# Altium schematic sheet JP-QDB.SchDoc
size A3
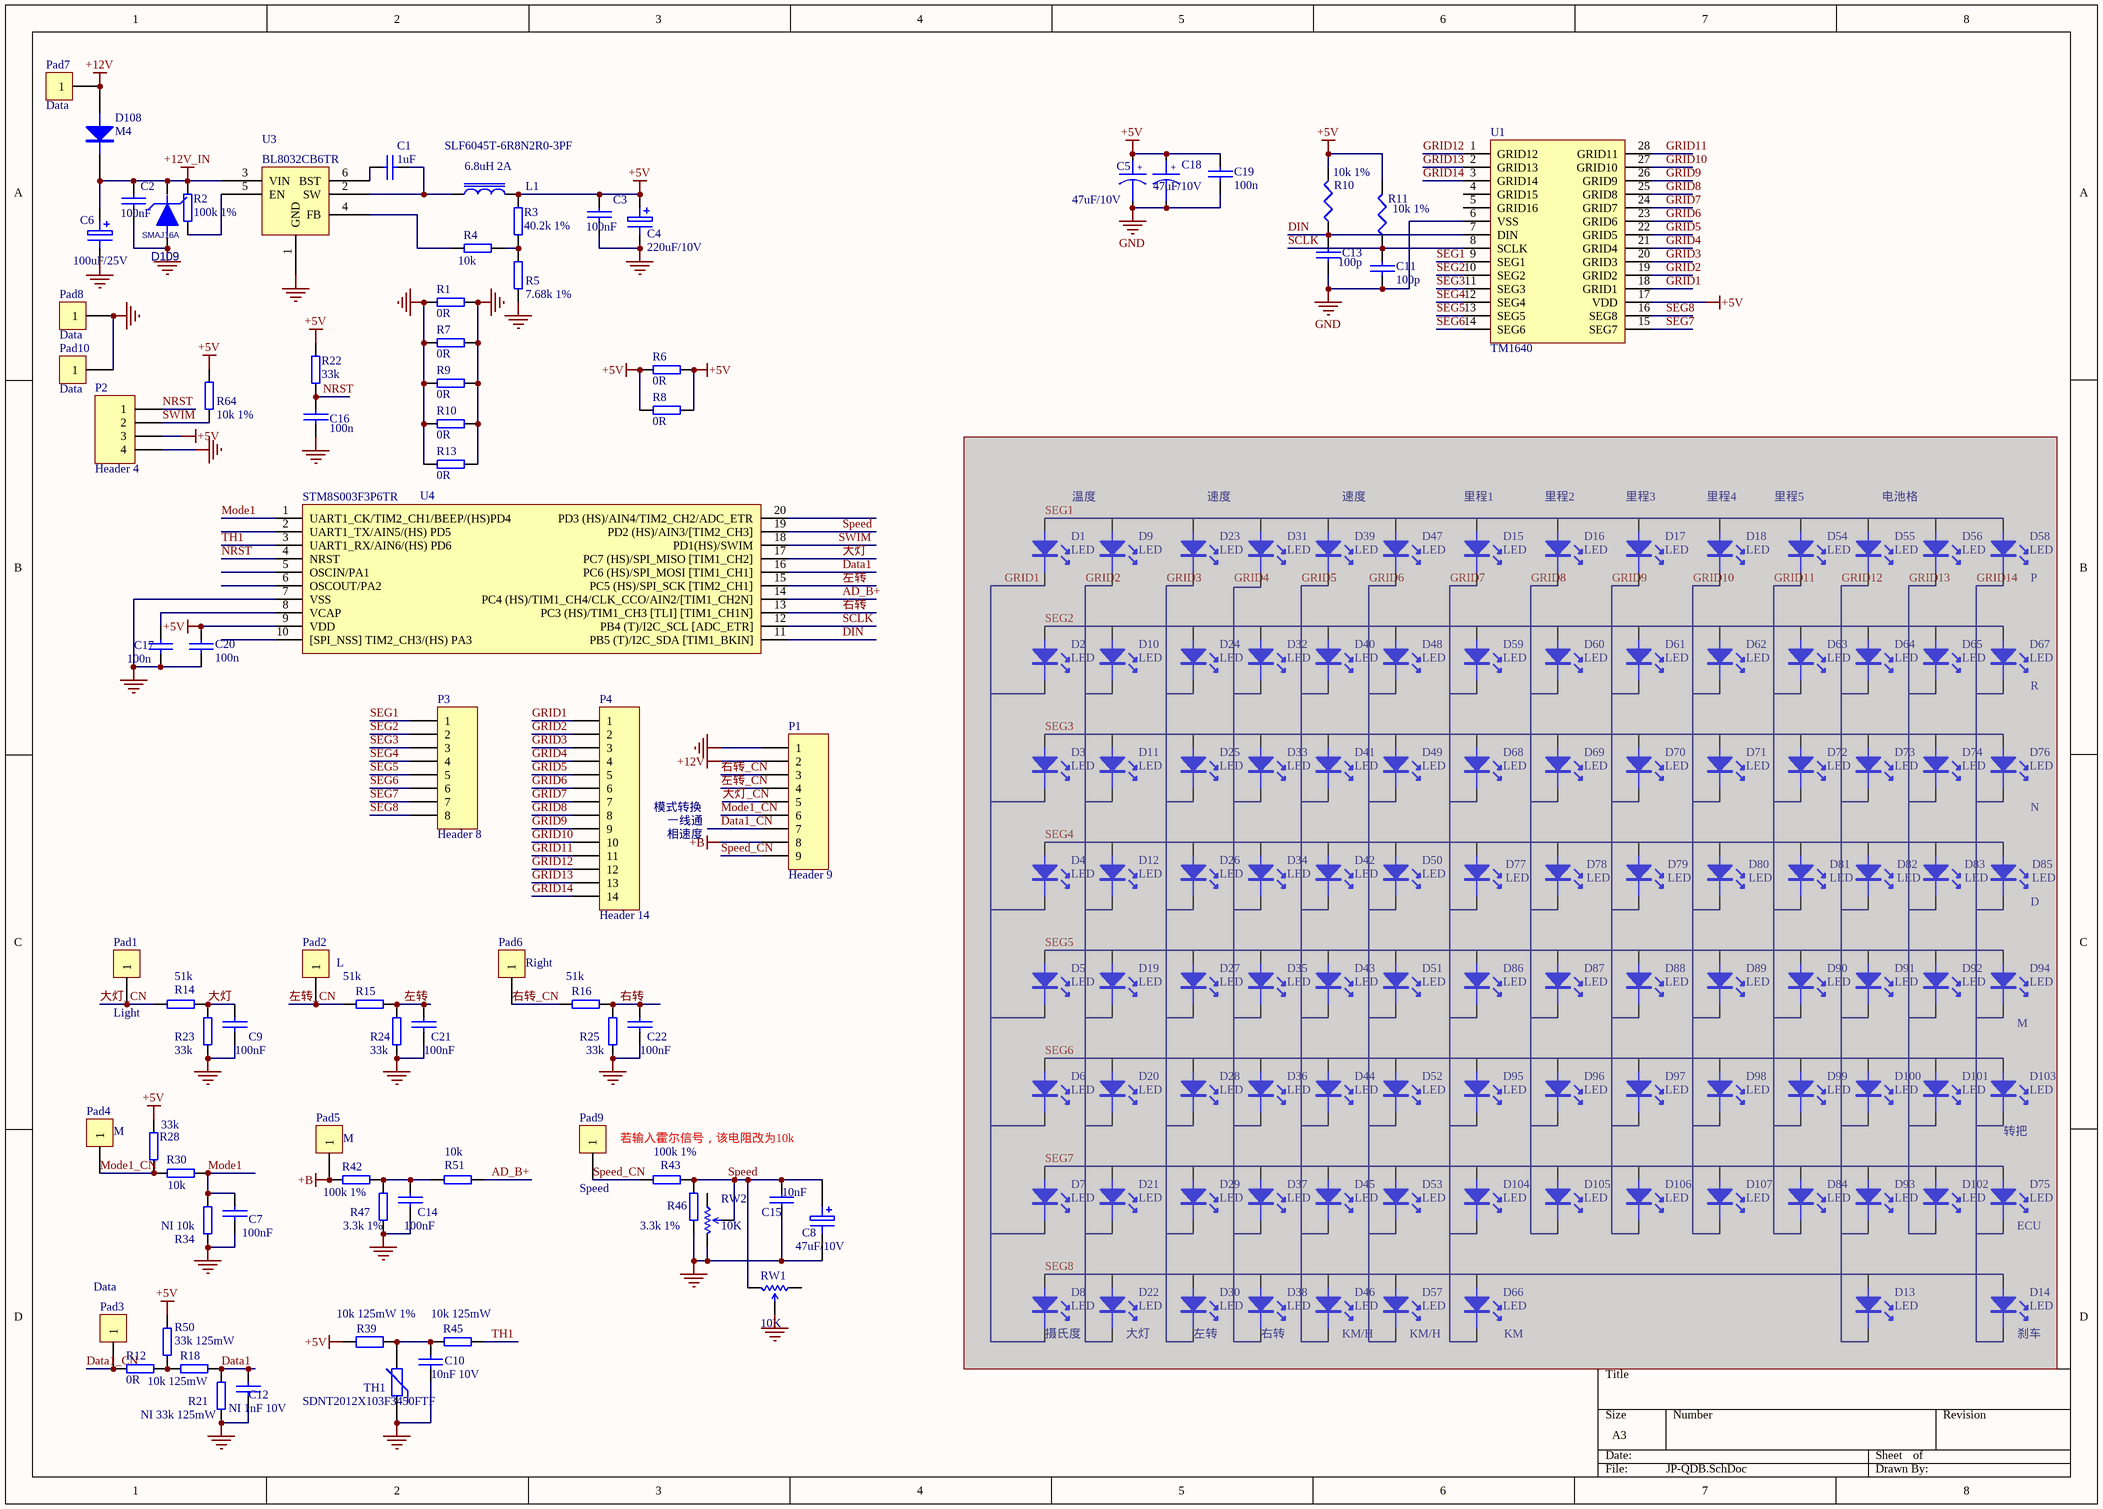
[diagram p0: JP-QDB.SchDoc]

## Parts
C1  1uF  [0805]
C2  100nF  [0805]
C3  100nF  [0805]
C4  220uF/10V  [CE-D6.4]
C5  47uF/10V  [CE-D5.2]
C6  100uF/25V  [RB.1/.2]
C7  100nF  [0805]
C8  47uF/10V  [RB.1/.2]
C9  100nF  [0805]
C10  10nF 10V  [0603]
C11  100p  [0805]
C12  NI 1nF 10V  [0603]
C13  100p  [0805]
C14  100nF  [0805]
C15  10nF  [0603]
C16  100n  [0603]
C17  100n  [0603]
C18  47uF/10V  [CE-D5.2]
C19  100n  [0603]
C20  100n  [0603]
C21  100nF  [0805]
C22  100nF  [0805]
D1  LED  [0603]  (masked out: inside a compile mask, not in the netlist)
D2  LED  [0603]  (masked out: inside a compile mask, not in the netlist)
D3  LED  [0603]  (masked out: inside a compile mask, not in the netlist)
D4  LED  [0603]  (masked out: inside a compile mask, not in the netlist)
D5  LED  [0603]  (masked out: inside a compile mask, not in the netlist)
D6  LED  [0603]  (masked out: inside a compile mask, not in the netlist)
D7  LED  [0603]  (masked out: inside a compile mask, not in the netlist)
D8  LED  [0603]  (masked out: inside a compile mask, not in the netlist)
D9  LED  [0603]  (masked out: inside a compile mask, not in the netlist)
D10  LED  [0603]  (masked out: inside a compile mask, not in the netlist)
D11  LED  [0603]  (masked out: inside a compile mask, not in the netlist)
D12  LED  [0603]  (masked out: inside a compile mask, not in the netlist)
D13  LED  [0603]  (masked out: inside a compile mask, not in the netlist)
D14  LED  [0603]  (masked out: inside a compile mask, not in the netlist)
D15  LED  [0603]  (masked out: inside a compile mask, not in the netlist)
D16  LED  [0603]  (masked out: inside a compile mask, not in the netlist)
D17  LED  [0603]  (masked out: inside a compile mask, not in the netlist)
D18  LED  [0603]  (masked out: inside a compile mask, not in the netlist)
D19  LED  [0603]  (masked out: inside a compile mask, not in the netlist)
D20  LED  [0603]  (masked out: inside a compile mask, not in the netlist)
D21  LED  [0603]  (masked out: inside a compile mask, not in the netlist)
D22  LED  [0603]  (masked out: inside a compile mask, not in the netlist)
D23  LED  [0603]  (masked out: inside a compile mask, not in the netlist)
D24  LED  [0603]  (masked out: inside a compile mask, not in the netlist)
D25  LED  [0603]  (masked out: inside a compile mask, not in the netlist)
D26  LED  [0603]  (masked out: inside a compile mask, not in the netlist)
D27  LED  [0603]  (masked out: inside a compile mask, not in the netlist)
D28  LED  [0603]  (masked out: inside a compile mask, not in the netlist)
D29  LED  [0603]  (masked out: inside a compile mask, not in the netlist)
D30  LED  [0603]  (masked out: inside a compile mask, not in the netlist)
D31  LED  [0603]  (masked out: inside a compile mask, not in the netlist)
D32  LED  [0603]  (masked out: inside a compile mask, not in the netlist)
D33  LED  [0603]  (masked out: inside a compile mask, not in the netlist)
D34  LED  [0603]  (masked out: inside a compile mask, not in the netlist)
D35  LED  [0603]  (masked out: inside a compile mask, not in the netlist)
D36  LED  [0603]  (masked out: inside a compile mask, not in the netlist)
D37  LED  [0603]  (masked out: inside a compile mask, not in the netlist)
D38  LED  [0603]  (masked out: inside a compile mask, not in the netlist)
D39  LED  [0603]  (masked out: inside a compile mask, not in the netlist)
D40  LED  [0603]  (masked out: inside a compile mask, not in the netlist)
D41  LED  [0603]  (masked out: inside a compile mask, not in the netlist)
D42  LED  [0603]  (masked out: inside a compile mask, not in the netlist)
D43  LED  [0603]  (masked out: inside a compile mask, not in the netlist)
D44  LED  [0603]  (masked out: inside a compile mask, not in the netlist)
D45  LED  [0603]  (masked out: inside a compile mask, not in the netlist)
D46  LED  [0603]  (masked out: inside a compile mask, not in the netlist)
D47  LED  [0603]  (masked out: inside a compile mask, not in the netlist)
D48  LED  [0603]  (masked out: inside a compile mask, not in the netlist)
D49  LED  [0603]  (masked out: inside a compile mask, not in the netlist)
D50  LED  [0603]  (masked out: inside a compile mask, not in the netlist)
D51  LED  [0603]  (masked out: inside a compile mask, not in the netlist)
D52  LED  [0603]  (masked out: inside a compile mask, not in the netlist)
D53  LED  [0603]  (masked out: inside a compile mask, not in the netlist)
D54  LED  [0603]  (masked out: inside a compile mask, not in the netlist)
D55  LED  [0603]  (masked out: inside a compile mask, not in the netlist)
D56  LED  [0603]  (masked out: inside a compile mask, not in the netlist)
D57  LED  [0603]  (masked out: inside a compile mask, not in the netlist)
D58  LED  [0603]  (masked out: inside a compile mask, not in the netlist)
D59  LED  [0603]  (masked out: inside a compile mask, not in the netlist)
D60  LED  [0603]  (masked out: inside a compile mask, not in the netlist)
D61  LED  [0603]  (masked out: inside a compile mask, not in the netlist)
D62  LED  [0603]  (masked out: inside a compile mask, not in the netlist)
D63  LED  [0603]  (masked out: inside a compile mask, not in the netlist)
D64  LED  [0603]  (masked out: inside a compile mask, not in the netlist)
D65  LED  [0603]  (masked out: inside a compile mask, not in the netlist)
D66  LED  [0603]  (masked out: inside a compile mask, not in the netlist)
D67  LED  [0603]  (masked out: inside a compile mask, not in the netlist)
D68  LED  [0603]  (masked out: inside a compile mask, not in the netlist)
D69  LED  [0603]  (masked out: inside a compile mask, not in the netlist)
D70  LED  [0603]  (masked out: inside a compile mask, not in the netlist)
D71  LED  [0603]  (masked out: inside a compile mask, not in the netlist)
D72  LED  [0603]  (masked out: inside a compile mask, not in the netlist)
D73  LED  [0603]  (masked out: inside a compile mask, not in the netlist)
D74  LED  [0603]  (masked out: inside a compile mask, not in the netlist)
D75  LED  [0603]  (masked out: inside a compile mask, not in the netlist)
D76  LED  [0603]  (masked out: inside a compile mask, not in the netlist)
D77  LED  [0603]  (masked out: inside a compile mask, not in the netlist)
D78  LED  [0603]  (masked out: inside a compile mask, not in the netlist)
D79  LED  [0603]  (masked out: inside a compile mask, not in the netlist)
D80  LED  [0603]  (masked out: inside a compile mask, not in the netlist)
D81  LED  [0603]  (masked out: inside a compile mask, not in the netlist)
D82  LED  [0603]  (masked out: inside a compile mask, not in the netlist)
D83  LED  [0603]  (masked out: inside a compile mask, not in the netlist)
D84  LED  [0603]  (masked out: inside a compile mask, not in the netlist)
D85  LED  [0603]  (masked out: inside a compile mask, not in the netlist)
D86  LED  [0603]  (masked out: inside a compile mask, not in the netlist)
D87  LED  [0603]  (masked out: inside a compile mask, not in the netlist)
D88  LED  [0603]  (masked out: inside a compile mask, not in the netlist)
D89  LED  [0603]  (masked out: inside a compile mask, not in the netlist)
D90  LED  [0603]  (masked out: inside a compile mask, not in the netlist)
D91  LED  [0603]  (masked out: inside a compile mask, not in the netlist)
D92  LED  [0603]  (masked out: inside a compile mask, not in the netlist)
D93  LED  [0603]  (masked out: inside a compile mask, not in the netlist)
D94  LED  [0603]  (masked out: inside a compile mask, not in the netlist)
D95  LED  [0603]  (masked out: inside a compile mask, not in the netlist)
D96  LED  [0603]  (masked out: inside a compile mask, not in the netlist)
D97  LED  [0603]  (masked out: inside a compile mask, not in the netlist)
D98  LED  [0603]  (masked out: inside a compile mask, not in the netlist)
D99  LED  [0603]  (masked out: inside a compile mask, not in the netlist)
D100  LED  [0603]  (masked out: inside a compile mask, not in the netlist)
D101  LED  [0603]  (masked out: inside a compile mask, not in the netlist)
D102  LED  [0603]  (masked out: inside a compile mask, not in the netlist)
D103  LED  [0603]  (masked out: inside a compile mask, not in the netlist)
D104  LED  [0603]  (masked out: inside a compile mask, not in the netlist)
D105  LED  [0603]  (masked out: inside a compile mask, not in the netlist)
D106  LED  [0603]  (masked out: inside a compile mask, not in the netlist)
D107  LED  [0603]  (masked out: inside a compile mask, not in the netlist)
D108  M4  [SMA]
D109  SMAJ16A  [SMA]
L1  SLF6045T-6R8N2R0-3PF  [L6025]
P1  Header 9  [SIP9]
P2  Header 4  [SIP4]
P3  Header 8  [HDR1X8]
P4  Header 14  [HDR1X14]
Pad1  Light  [PAD]
Pad2  L  [PAD]
Pad3  Data  [PAD]
Pad4  M  [PAD]
Pad5  M  [PAD]
Pad6  Right  [PAD]
Pad7  Data  [PAD]
Pad8  Data  [PAD]
Pad9  Speed  [PAD]
Pad10  Data  [PAD]
R1  0R  [1206]
R2  100k 1%  [0805]
R3  40.2k 1%  [0805]
R4  10k  [0603]
R5  7.68k 1%  [0603]
R6  0R  [1206]
R7  0R  [1206]
R8  0R  [1206]
R9  0R  [0805]
R10  10k 1%  [0805]
R10  0R  [0805]
R11  10k 1%  [0805]
R12  0R  [0805]
R13  0R  [0805]
R14  51k  [0805]
R15  51k  [0805]
R16  51k  [0805]
R18  10k 125mW  [0805]
R21  NI 33k 125mW  [0805]
R22  33k  [0805]
R23  33k  [0805]
R24  33k  [0805]
R25  33k  [0805]
R28  33k  [0805]
R30  10k  [0805]
R34  NI 10k  [0805]
R39  10k 125mW 1%  [0805]
R42  100k 1%  [0805]
R43  100k 1%  [0805]
R45  10k 125mW  [0805]
R46  3.3k 1%  [0805]
R47  3.3k 1%  [0805]
R50  33k 125mW  [0805]
R51  10k  [0805]
R64  10k 1%  [0805]
RW1  10K  [ADJRES]
RW2  10K  [RW1]
TH1  SDNT2012X103F3450FTF  [0805]
U1  TM1640  [SOP28]
U3  BL8032CB6TR  [SOT23-6]
U4  STM8S003F3P6TR  [SSOP20]

## Nets
+5V: C3.1 C4.1 C5.1 C18.1 C19.2 C20.2 L1.2 P2.3 R3.1 R6.1 R6.2 R8.1 R8.2 R10.2 R11.2 R22.2 R28.1 R39.2 R50.1 R64.1 U1.17(VDD) U4.9(VDD)
+12V: D108.1(A) P1.2 Pad7.1
+12V_IN: C2.1 C6.1 D108.2(K) D109.2 R2.1 U3.3(VIN)
+B: P1.8 Pad5.1 R42.2
GND: C2.2 C3.2 C4.2 C5.2 C6.2 C7.2 C8.2 C9.2 C10.2 C11.1 C12.2 C13.1 C14.2 C15.2 C16.1 C17.2 C18.2 C19.1 C20.1 C21.2 C22.2 D109.1 P1.1 P2.4 Pad8.1 Pad10.1 R1.1 R1.2 R5.1 R7.1 R7.2 R9.1 R9.2 R10.1 R10.2 R13.1 R13.2 R21.2 R23.2 R24.2 R25.2 R34.2 R46.2 R47.2 RW1.3 RW2.1 TH1.1 U1.6(VSS) U3.1(GND) U4.7(VSS)
AD_B+: R51.1 U4.14(PC4_(HS)/TIM1_CH4/CLK_CCO/AIN2/[TIM1_CH2N])
Data1: C12.1 R18.1 R21.1 U4.16(PC6_(HS)/SPI_MOSI_[TIM1_CH1])
Data1_CN: P1.7 Pad3.1 R12.1
DIN: C13.2 R10.1 U1.7(DIN) U4.11(PB5_(T)/I2C_SDA_[TIM1_BKIN])
GRID1: P4.1 U1.18(GRID1)
GRID2: P4.2 U1.19(GRID2)
GRID3: P4.3 U1.20(GRID3)
GRID4: P4.4 U1.21(GRID4)
GRID5: P4.5 U1.22(GRID5)
GRID6: P4.6 U1.23(GRID6)
GRID7: P4.7 U1.24(GRID7)
GRID8: P4.8 U1.25(GRID8)
GRID9: P4.9 U1.26(GRID9)
GRID10: P4.10 U1.27(GRID10)
GRID11: P4.11 U1.28(GRID11)
GRID12: P4.12 U1.1(GRID12)
GRID13: P4.13 U1.2(GRID13)
GRID14: P4.14 U1.3(GRID14)
Mode1: C7.1 R30.1 R34.1 U4.1(UART1_CK/TIM2_CH1/BEEP/(HS)PD4)
Mode1_CN: P1.6 Pad4.1 R28.2 R30.2
NRST: C16.2 P2.1 R22.1 U4.4(NRST)
SCLK: C11.2 R11.1 U1.8(SCLK) U4.12(PB4_(T)/I2C_SCL_[ADC_ETR])
SEG1: P3.1 U1.9(SEG1)
SEG2: P3.2 U1.10(SEG2)
SEG3: P3.3 U1.11(SEG3)
SEG4: P3.4 U1.12(SEG4)
SEG5: P3.5 U1.13(SEG5)
SEG6: P3.6 U1.14(SEG6)
SEG7: P3.7 U1.15(SEG7)
SEG8: P3.8 U1.16(SEG8)
Speed: C8.1 C15.1 R43.1 R46.1 RW1.1 RW2.3 U4.19(PD2_(HS)/AIN3/[TIM2_CH3])
Speed_CN: P1.9 Pad9.1 R43.2
SWIM: P2.2 R64.2 U4.18(PD1(HS)/SWIM)
TH1: R45.1 U4.3(UART1_RX/AIN6/(HS)_PD6)
右转: C22.1 R16.1 R25.1 U4.13(PC3_(HS)/TIM1_CH3_[TLI]_[TIM1_CH1N])
右转_CN: P1.3 Pad6.1 R16.2
大灯: C9.1 R14.1 R23.1 U4.17(PC7_(HS)/SPI_MISO_[TIM1_CH2])
大灯_CN: P1.5 Pad1.1 R14.2
左转: C21.1 R15.1 R24.1 U4.15(PC5_(HS)/SPI_SCK_[TIM2_CH1])
左转_CN: P1.4 Pad2.1 R15.2
NetC1_1: C1.1 L1.1 U3.2(SW)
NetC1_2: C1.2 U3.6(BST)
NetC10_1: C10.1 R39.1 R45.2 TH1.2
NetC14_1: C14.1 R42.1 R47.1 R51.2
NetC17_1: C17.1 U4.8(VCAP)
NetR2_2: R2.2 U3.5(EN)
NetR3_2: R3.2 R4.1 R5.2
NetR4_2: R4.2 U3.4(FB)
NetR12_2: R12.2 R18.2 R50.2

Not connected (* = marked no-connect by the designer): RW1 2; RW2 2; U1 4(GRID15) 5(GRID16); U4 2(UART1_TX/AIN5/(HS)_PD5) 5(OSCIN/PA1) 6(OSCOUT/PA2) 10([SPI_NSS]_TIM2_CH3/(HS)_PA3) 20(PD3_(HS)/AIN4/TIM2_CH2/ADC_ETR)

## Notes on the sheet
- 温度
- (near D23) 速度
- (near D39) 速度
- (near D15) 里程1
- (near D16) 里程2
- (near D17) 里程3
- (near D18) 里程4
- (near D54) 里程5
- 电池格
- (near D58) P
- (near D67) R
- 模式转换
- 一线通
- 相速度
- N
- (near D85) D
- (near D94) M
- 若输入霍尔信号，该电阻改为10k
- (near D103) 转把
- (near D75) ECU
- (near D8) 摄氏度
- (near D22) 大灯
- (near D30) 左转
- (near D38) 右转
- (near D46) KM/H
- (near D57) KM/H
- (near D66) KM
- (near D14) 刹车
- (in symbol Capacitor) +
- (in symbol WHLL) 6.8uH 2A

## Library data of the parts
C1 = WHLCAP
C2 C3 C7 C9 C10 C12 C14 C15 C17 C21 C22 = CAP: Capacitor
C4 C6 = ELECTRO1: Electrolytic Capacitor
C5 C18 = Capacitor
C8 = ELECTRO1: Electrolytic Capacitor; Pressure: 25V
C11 C13 C16 C19 C20 = Cap
D108 = DIODE
D109 = DO-214AC_SMAJ: 5.1V,500mW,323; Manufacture 1: VISHAY; 中文名称: 贴片TVS二极管; 物料描述: SMA-DO-214AC; Geometry.Height: 1.1mm; Value: SMAJ16A; PCB DECAL: DO-214AC_SMAJ
L1 = WHLL
P1 = Header 9: Header, 9-Pin; LatestRevisionDate: 17-Jul-2002; LatestRevisionNote: Re-released for DXP Platform.; Publisher: Altium Limited
P2 = Header 4: Header, 4-Pin; LatestRevisionDate: 17-Jul-2002; LatestRevisionNote: Re-released for DXP Platform.; Publisher: Altium Limited
P3 = Header 8: Header, 8-Pin; LatestRevisionDate: 17-Jul-2002; LatestRevisionNote: Re-released for DXP Platform.; Publisher: Altium Limited
P4 = Header 14: Header, 14-Pin; LatestRevisionDate: 17-Jul-2002; LatestRevisionNote: Re-released for DXP Platform.; Publisher: Altium Limited
Pad1-Pad10 = CON1: Connector
R1-R10 R12-R16 R18 R21 R23-R25 R28 R30 R34 R42 R43 R45-R47 R50 R51 R64 = WHLRES
R10 R11 = RES1
R22 = WHLRES: Power: 125mW
R39 = Res2: Resistor; Published: 8-Jun-2000; LatestRevisionDate: 17-Jul-2002; LatestRevisionNote: Re-released for DXP Platform.; PackageReference: AXIAL-0.4; Publisher: Altium Limited
RW1 RW2 = RW1
TH1 = Res Varistor: Varistor (Voltage-Sensitive Resistor); Published: 24-Mar-1999; LatestRevisionDate: 04-Mar-2005; LatestRevisionNote: PCB Footprint replaced.; PackageReference: 6-0805; Publisher: Altium Limited
U3 = BL8032
U4 = STM8S003F3P6